# Altium schematic sheet 5_Regulator.SchDoc
size A4; SheetNumber: 6; SheetTotal: 6
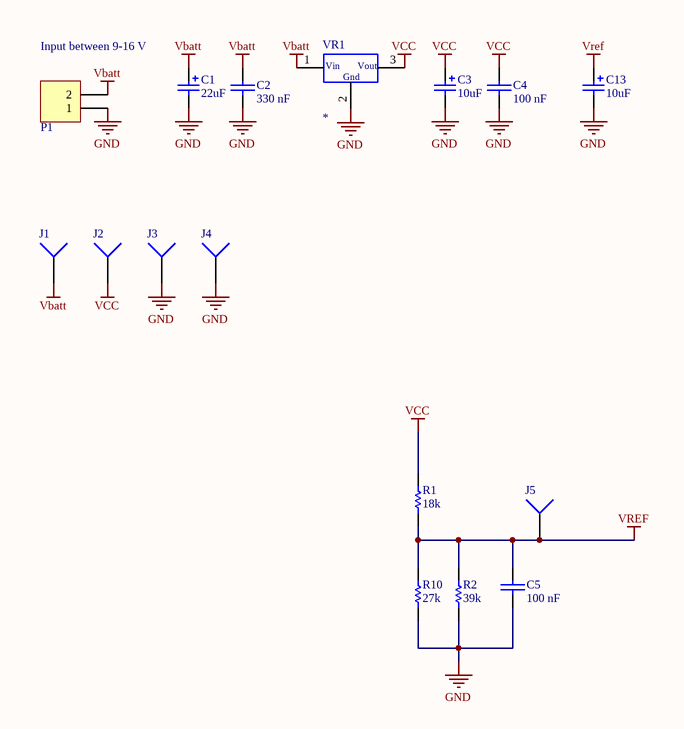
[diagram p0: 5_Regulator.SchDoc]

## Parts
C1  22uF  [ece-CAPAD2TH0.3]
C2  330 nF  [ece-RAD0.2]
C3  10uF  [ece-CAPAD2TH0.3]
C4  100 nF  [ece-RAD0.2]
C5  100 nF  [ece-RAD0.2]
C13  10uF  [ece-CAPAD2TH0.3]
J1  Vbatt  [ece-HDR1]  (value not drawn)
J2  Vcc  [ece-HDR1]  (value not drawn)
J3  GND  [ece-HDR1]  (value not drawn)
J4  GND  [ece-HDR1]  (value not drawn)
J5  Vcc/2  [ece-HDR1]  (value not drawn)
P1  Header 2  [ece-TER2-10MM]  (value not drawn)
R1  18k  [ece-AXIAL0.4]
R2  39k  [ece-AXIAL0.4]
R10  27k  [ece-AXIAL0.4]
VR1  *  [ece-TO220]

## Nets
GND: C1.2 C2.2 C3.2 C4.2 C5.2 C13.2 J3.1 J4.1 P1.1 R2.1 R10.1 VR1.2(Gnd)
Vbatt: C1.1 C2.1 J1.1 P1.2 VR1.1(Vin)
VCC: C3.1 C4.1 J2.1 R1.2 VR1.3(Vout)
VREF: C5.1 C13.1 J5.1 R1.1 R2.2 R10.2

## Notes on the sheet
- Input between 9-16 V

## Library data of the parts
C1 C3 C13 = CAP 22uF TH: Polarized Capacitor (Radial); Manufacturer: Generic Components; Class I: Passive; Published: 8-Jun-2000; Revision: July-2002: Re-released for DXP Platform.; Publisher: Altium Limited; Class II: Capacitor
  C1: Value: 22uF
  C3 C13: Value: 10uF
C2 C4 C5 = CAP: Capacitor Non Polarised Through Hole
  C2: Value: 330 nF
  C4 C5: Value: 100 nF
J1-J5 = Test pin: Socket; LatestRevisionDate: 17-Jul-2002; LatestRevisionNote: Re-released for DXP Platform.; Publisher: Altium Limited
P1 = TERMINAL 2: Large 2 way screw connector
R1 R2 R10 = Res1: Resistor; Published: 8-Jun-2000; LatestRevisionDate: 17-Jul-2002; LatestRevisionNote: Re-released for DXP Platform.; PackageReference: AXIAL-0.3; Publisher: Altium Limited
  R1: Value: 18k
  R2: Value: 39k
  R10: Value: 27k
VR1 = VoltRegBig: Voltage Regulator; Value: *